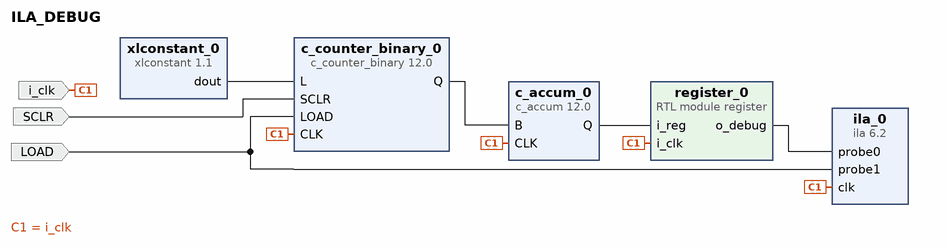
[diagram p0: block diagram of the top level]
# Vivado block design ILA_DEBUG, xc7a35ticsg324-1L, Vivado 2022.2
create_bd_design ILA_DEBUG

create_bd_port -dir I -type data LOAD
create_bd_port -dir I -type rst SCLR
set_property -dict {CONFIG.POLARITY ACTIVE_HIGH} [get_bd_ports SCLR]
create_bd_port -dir I -type clk i_clk
set_property -dict {CONFIG.FREQ_HZ 100000000} [get_bd_ports i_clk]

create_bd_cell -type ip -vlnv xilinx.com:ip:c_accum:12.0 c_accum_0
set_property -dict [list \
  CONFIG.Bypass false \
  CONFIG.CE false \
  CONFIG.Implementation DSP48 \
  CONFIG.Input_Type Unsigned \
  CONFIG.Input_Width 16 \
] [get_bd_cells c_accum_0]
create_bd_cell -type ip -vlnv xilinx.com:ip:c_counter_binary:12.0 c_counter_binary_0
set_property -dict {CONFIG.CE false CONFIG.Load true CONFIG.SCLR true} [get_bd_cells c_counter_binary_0]
create_bd_cell -type ip -vlnv xilinx.com:ip:xlconstant:1.1 xlconstant_0
set_property -dict {CONFIG.CONST_VAL 1 CONFIG.CONST_WIDTH 16} [get_bd_cells xlconstant_0]
create_bd_cell -type ip -vlnv xilinx.com:ip:ila:6.2 ila_0
set_property -dict [list \
  CONFIG.C_EN_STRG_QUAL 1 \
  CONFIG.C_MONITOR_TYPE Native \
  CONFIG.C_NUM_OF_PROBES 2 \
  CONFIG.C_PROBE0_WIDTH 32 \
  CONFIG.C_PROBE1_TYPE 0 \
] [get_bd_cells ila_0]
create_bd_cell -type module -reference register register_0

# ---- connections ----

connect_bd_net -net CLK_1 [get_bd_ports i_clk] \
  [get_bd_pins c_counter_binary_0/CLK] [get_bd_pins c_accum_0/CLK] [get_bd_pins ila_0/clk] [get_bd_pins register_0/i_clk]
connect_bd_net [get_bd_ports LOAD] [get_bd_pins c_counter_binary_0/LOAD] [get_bd_pins ila_0/probe1]
connect_bd_net [get_bd_ports SCLR] [get_bd_pins c_counter_binary_0/SCLR]
connect_bd_net [get_bd_pins c_accum_0/Q] [get_bd_pins register_0/i_reg]
connect_bd_net [get_bd_pins c_counter_binary_0/Q] [get_bd_pins c_accum_0/B]
connect_bd_net [get_bd_pins register_0/o_debug] [get_bd_pins ila_0/probe0]
connect_bd_net [get_bd_pins xlconstant_0/dout] [get_bd_pins c_counter_binary_0/L]

validate_bd_design
save_bd_design
